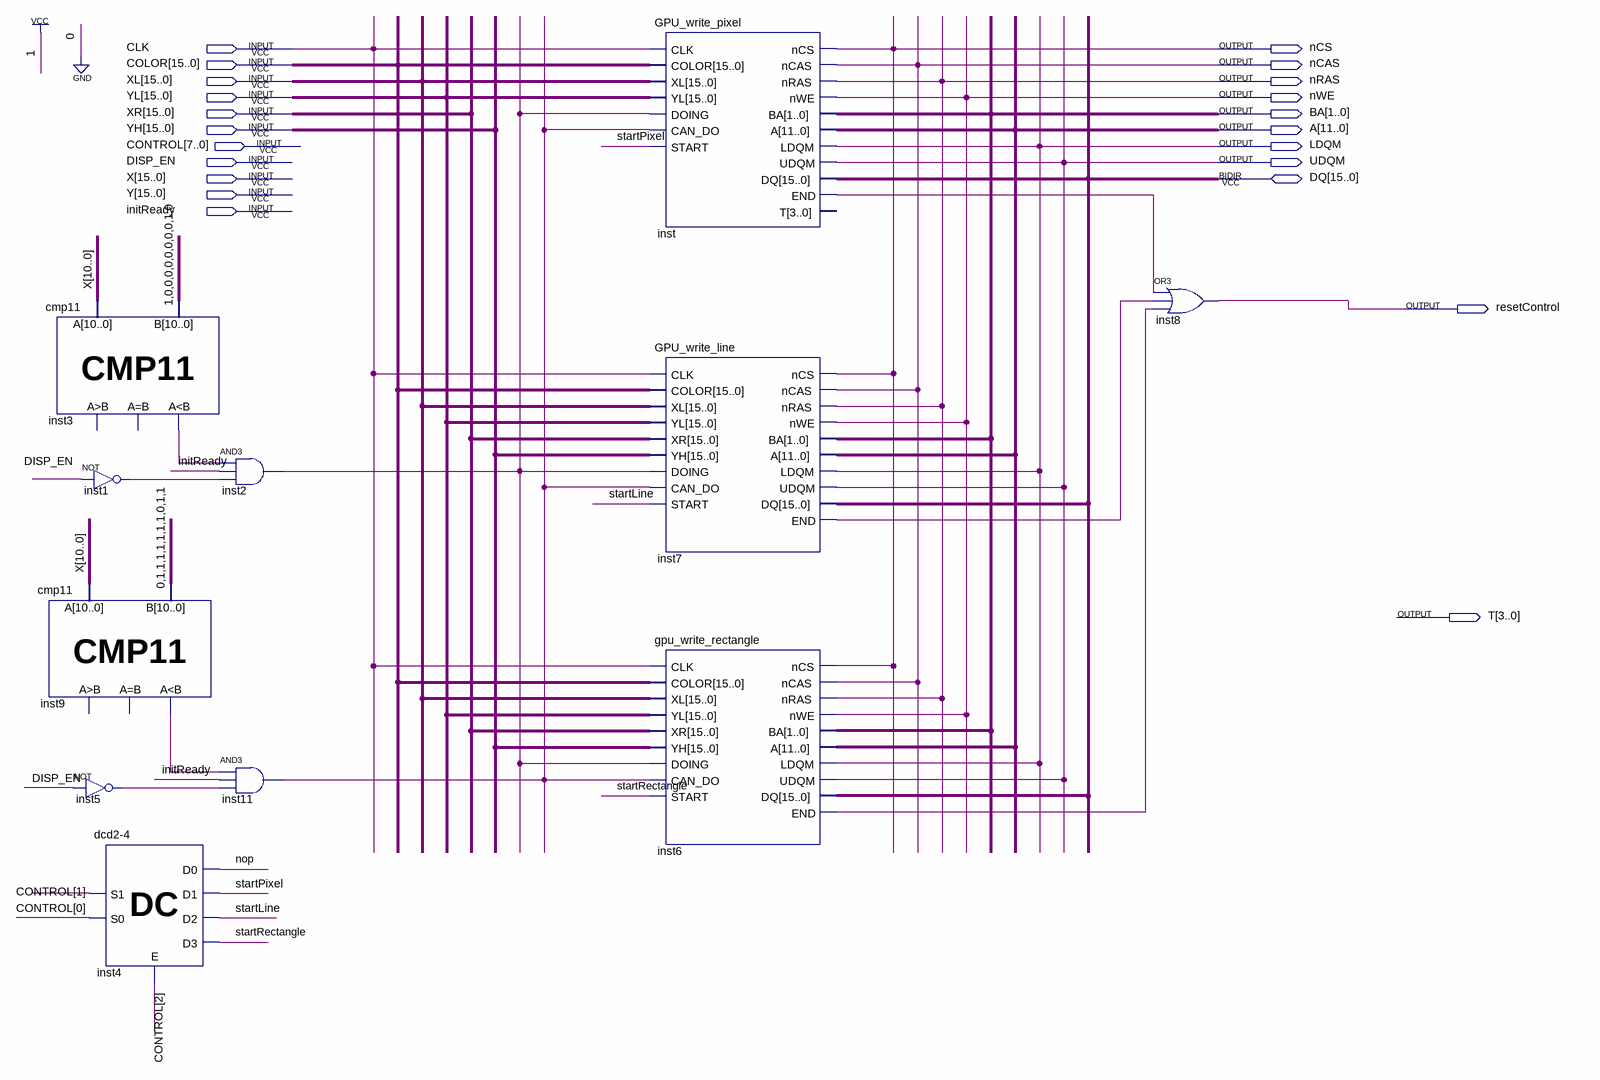
[diagram p0: schematic sheet]
// Quartus schematic GPU_write.bdf as structural Verilog: 11 symbols, 22 pins
module GPU_write (
  input  CLK,
  input  [15:0] COLOR,
  input  [15:0] XL,
  input  [15:0] YL,
  input  [15:0] XR,
  input  [15:0] YH,
  input  [7:0] CONTROL,
  input  DISP_EN,
  input  [15:0] X,
  input  [15:0] Y,
  input  initReady,
  inout  [15:0] DQ,
  output nCS,
  output nCAS,
  output nRAS,
  output nWE,
  output [1:0] BA,
  output [11:0] A,
  output LDQM,
  output UDQM,
  output resetControl,
  output [3:0] T
);

  wire inst1_out, inst2_out, inst3_ls, inst5_out, inst6_end, inst7_end, inst9_ls, inst11_out, inst_end, nop,
       startLine, startPixel, startRectangle;

  cmp11 inst3 (.A(X[10:0]), .B(11'b10000000010), .Ls(inst3_ls));  // open: Eq, Gt
  cmp11 inst9 (.A(X[10:0]), .B(11'b01111111011), .Ls(inst9_ls));  // open: Eq, Gt
  not inst1 (inst1_out, DISP_EN);
  not inst5 (inst5_out, DISP_EN);
  \dcd2-4  inst4 (
    .E(CONTROL[2]), .S1(CONTROL[1]), .S0(CONTROL[0]), .D0(nop), .D1(startPixel), .D2(startLine),
    .D3(startRectangle));
  and inst2 (inst2_out, inst3_ls, initReady, inst1_out);
  and inst11 (inst11_out, inst9_ls, initReady, inst5_out);
  GPU_write_pixel inst (
    .CLK(CLK), .COLOR(COLOR), .XL(XL), .YL(YL), .DOING(inst2_out), .CAN_DO(inst11_out), .START(startPixel),
    .nCS(nCS), .nCAS(nCAS), .nRAS(nRAS), .nWE(nWE), .BA(BA), .A(A), .LDQM(LDQM), .UDQM(UDQM), .END(inst_end),
    .DQ(DQ));  // open: T
  GPU_write_line inst7 (
    .CLK(CLK), .COLOR(COLOR), .XL(XL), .YL(YL), .XR(XR), .YH(YH), .DOING(inst2_out), .CAN_DO(inst11_out),
    .START(startLine), .nCS(nCS), .nCAS(nCAS), .nRAS(nRAS), .nWE(nWE), .BA(BA), .A(A), .LDQM(LDQM),
    .UDQM(UDQM), .END(inst7_end), .DQ(DQ));
  gpu_write_rectangle inst6 (
    .CLK(CLK), .COLOR(COLOR), .XL(XL), .YL(YL), .XR(XR), .YH(YH), .DOING(inst2_out), .CAN_DO(inst11_out),
    .START(startRectangle), .nCS(nCS), .nCAS(nCAS), .nRAS(nRAS), .nWE(nWE), .BA(BA), .A(A), .LDQM(LDQM),
    .UDQM(UDQM), .END(inst6_end), .DQ(DQ));
  or inst8 (resetControl, inst_end, inst7_end, inst6_end);
endmodule
